# Altium schematic sheet V1.SchDoc
size A2; SheetNumber: 1; SheetTotal: 2
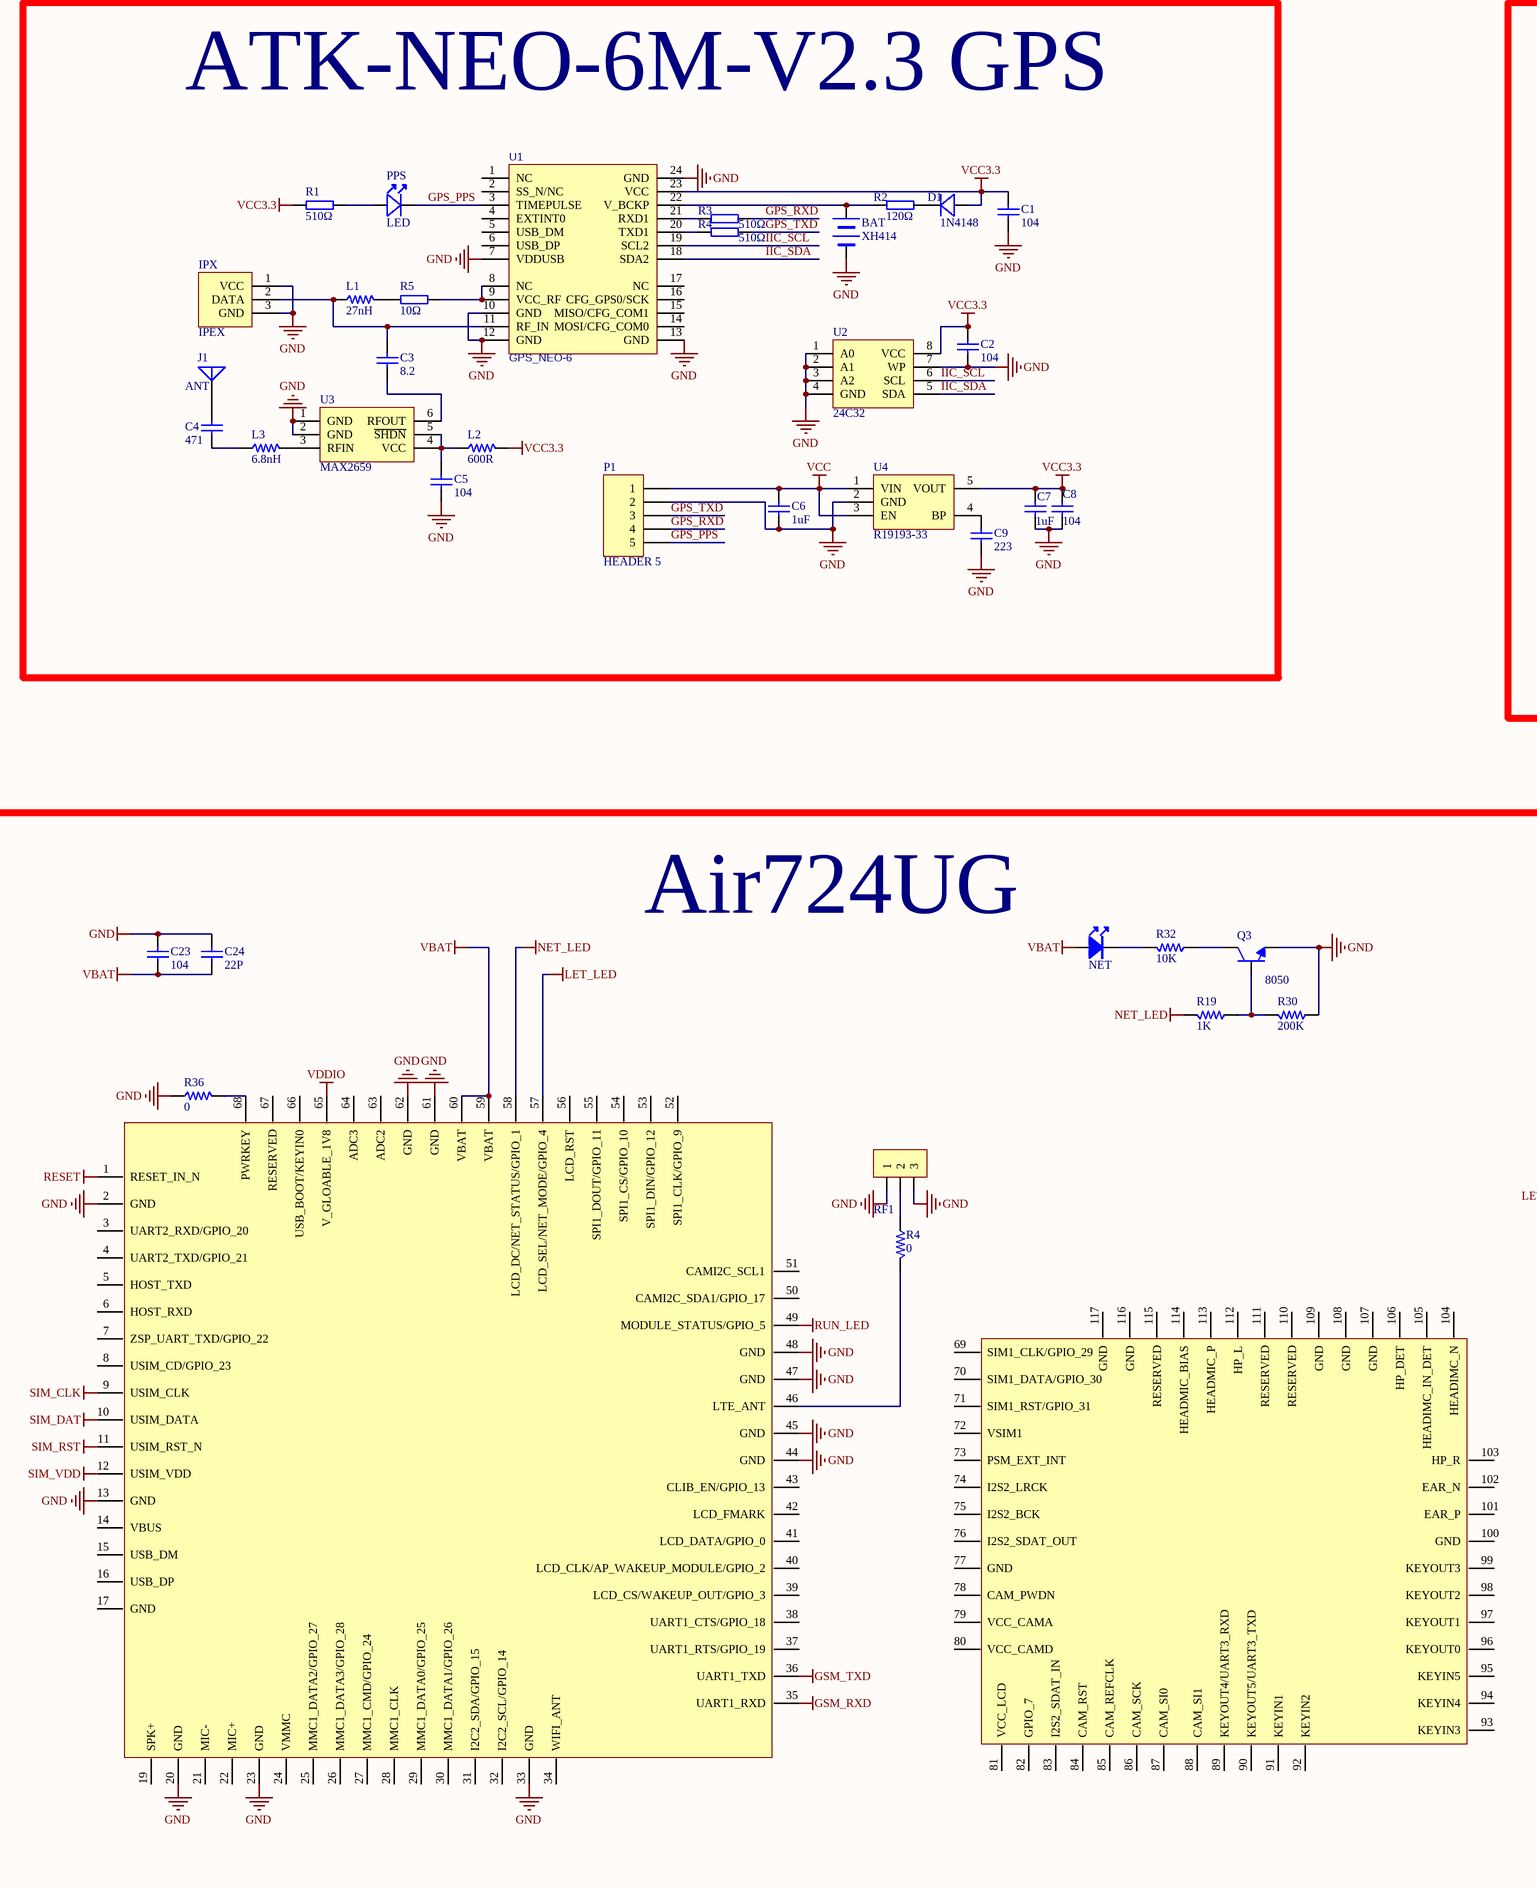
[diagram p0: V1.SchDoc, left]
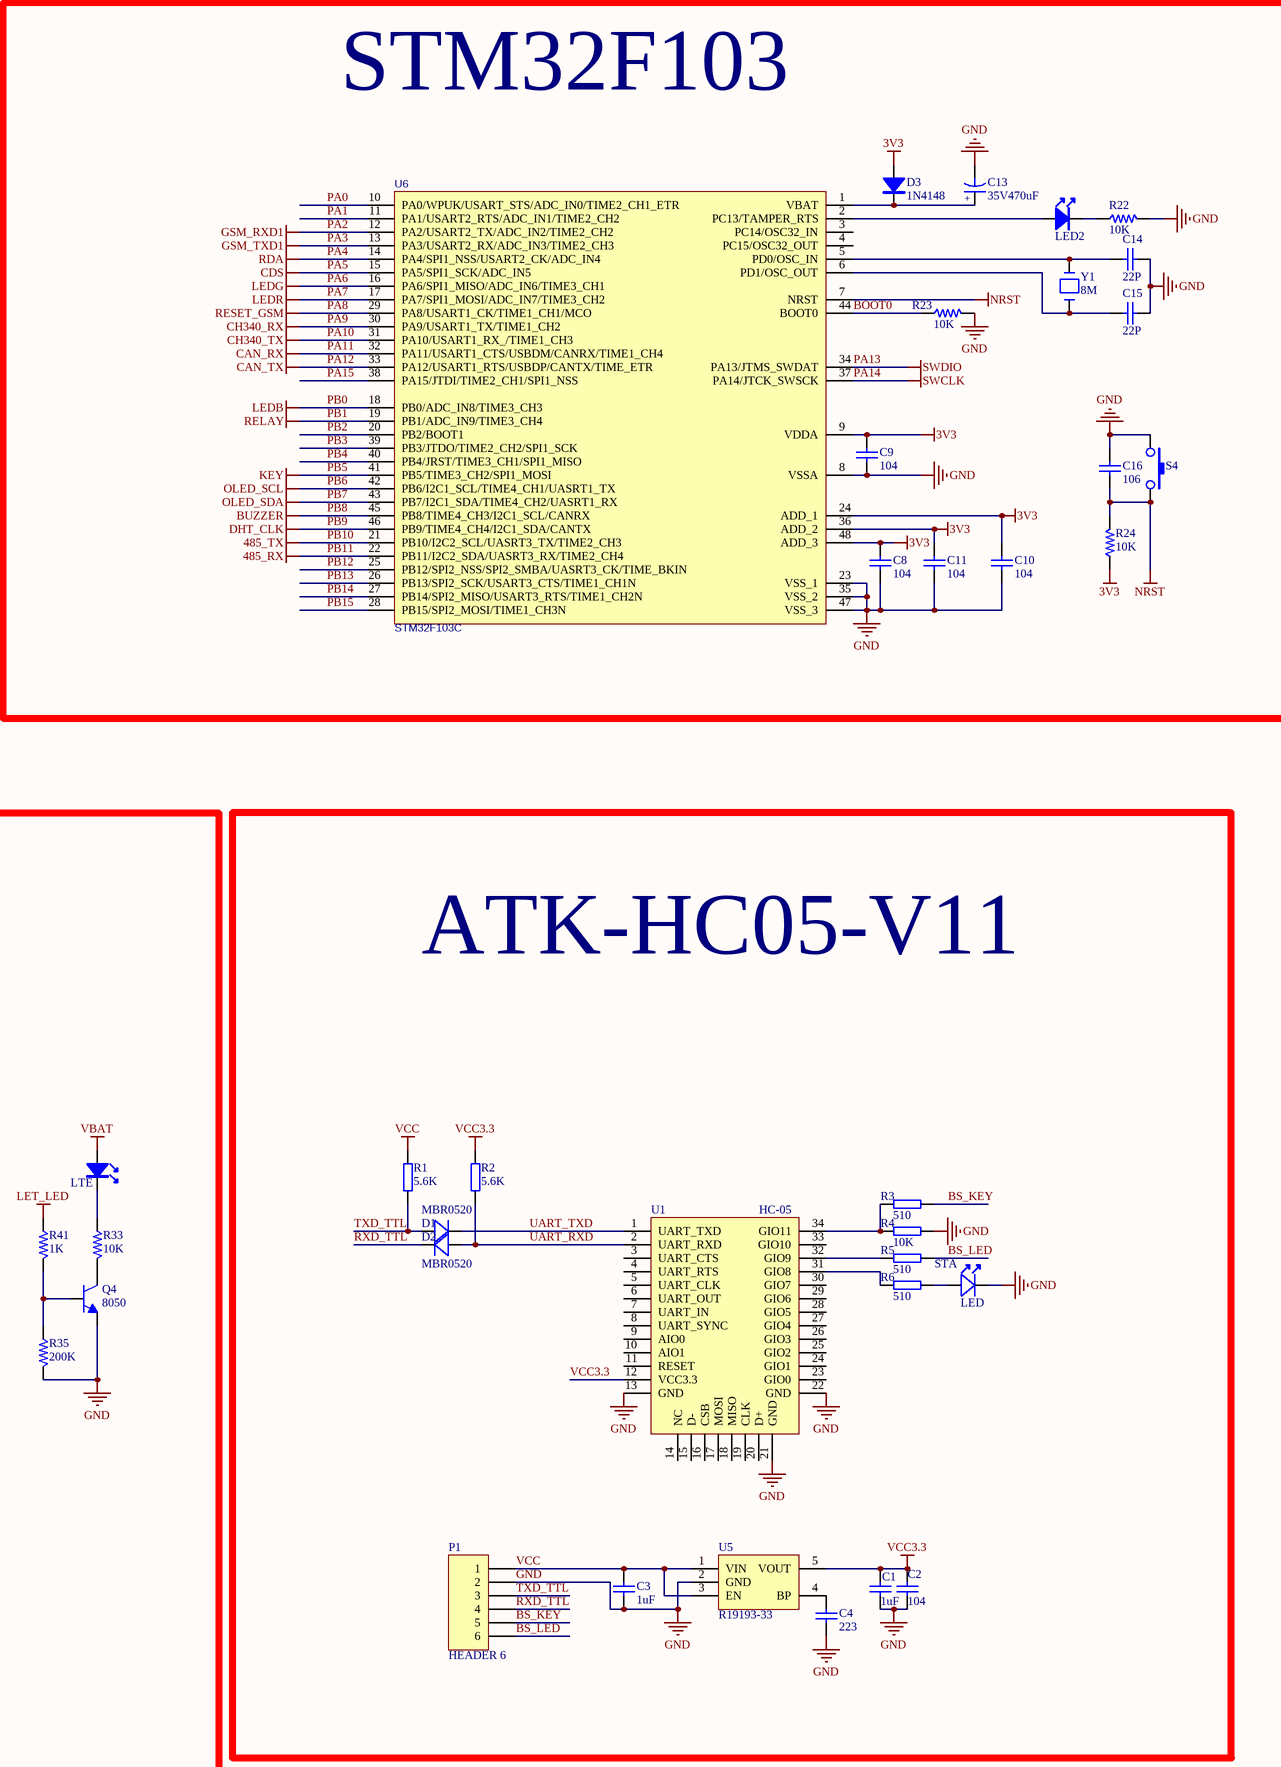
[diagram p1: V1.SchDoc, right]

## Parts
(Parts that share a designator on the sheet are numbered #1, #2 ... from top to bottom, then left to right.)
BAT  XH414  [SIP2]
C1#1  104  [RAD0.1]
C1#2  1uF  [RAD0.1]
C2#1  104  [RAD0.1]
C2#2  104  [RAD0.1]
C3#1  8.2  [RAD0.1]
C3#2  1uF  [RAD0.1]
C4#1  471  [RAD0.1]
C4#2  223  [RAD0.1]
C5  104  [RAD0.1]
C6  1uF  [RAD0.1]
C7  1uF  [RAD0.1]
C8#1  104  [RAD0.1]
C8#2  104  [RAD0.1]
C9#1  104  [RAD0.1]
C9#2  223  [RAD0.1]
C10  104  [RAD0.1]
C11  104  [RAD0.1]
C13  35V470uF  [RB.1/.2]
C14  22P  [RAD0.1]
C15  22P  [RAD0.1]
C16  106  [RAD0.1]
C23  104  [RAD0.1]
C24  22P  [RAD0.1]
D1#1  1N4148  [DIODE0.4]
D1#2  MBR0520  [DIODE0.4]
D2  MBR0520  [DIODE0.4]
D3  1N4148  [DIODE0.4]
IPX  IPEX  [SIP3]
J1  ANT  [SMA-5.08]
L1  27nH  [AXIAL0.4]
L2  600R  [AXIAL0.4]
L3  6.8nH  [AXIAL0.4]
LED2  LED  [LED]  (value not drawn)
LTE  LED  [LED]  (value not drawn)
NET  LED  [LED]  (value not drawn)
P1#1  HEADER 5  [SIP5]
P1#2  HEADER 6  [SIP6]
PPS  LED  [LED]
Q3  8050  [TO-92-EBC]
Q4  8050  [TO-92-EBC]
R1#1  510Ω  [AXIAL0.4]
R1#2  5.6K  [AXIAL0.4]
R2#1  120Ω  [AXIAL0.4]
R2#2  5.6K  [AXIAL0.4]
R3#1  510Ω  [AXIAL0.4]
R3#2  510  [AXIAL0.4]
R4#1  510Ω  [AXIAL0.4]
R4#2  0  [AXIAL0.4]
R4#3  10K  [AXIAL0.4]
R5#1  10Ω  [AXIAL0.4]
R5#2  510  [AXIAL0.4]
R6  510  [AXIAL0.4]
R19  1K  [AXIAL0.4]
R22  10K  [AXIAL0.4]
R23  10K  [AXIAL0.4]
R24  10K  [AXIAL0.4]
R30  200K  [AXIAL0.4]
R32  10K  [AXIAL0.4]
R33  10K  [AXIAL0.4]
R35  200K  [AXIAL0.4]
R36  0  [AXIAL0.4]
R41  1K  [AXIAL0.4]
RF1  CON3  [SIP3]  (value not drawn)
S4  SW-PB  [SW6X6]  (value not drawn)
STA  LED  [LED]
U1#1  GPS_NEO-6  [GPS_NEO-6]
U1#2  HC-05
U2  24C32  [DIP8]
U3  MAX2659
U4  R19193-33
U5  R19193-33
U6  STM32F103C  [LQFP48(STM32F103X8/STM32F103XB)]
U7  Air724UG  [AIR724UG.1]  (value not drawn)  (parts A,B of 2)
Y1  8M  [XTAL1]

## Blocks framed on the sheet
ATK-NEO-6M-V2.3 GPS: BAT C1#1 C2#1 C3#1 C4#1 C5-C7 C8#1 C9#2 D1#1 IPX J1 L1-L3 P1#1 PPS R1#1 R2#1 R3#1 R4#1 R5#1 U1#1 U2-U4
STM32F103: C8#2 C9#1 C10 C11 C13-C16 D3 LED2 R22-R24 S4 U6 Y1
Air724UG: C23 C24 LTE NET Q3 Q4 R4#2 R19 R30 R32 R33 R35 R36 R41 RF1 U7
ATK-HC05-V11: C1#2 C2#2 C3#2 C4#2 D1#2 D2 P1#2 R1#2 R2#2 R3#2 R4#3 R5#2 R6 STA U1#2 U5

## Nets
3V3: C8#2.2 C9#1.2 C10.2 C11.2 D3.1(A) R24.1 U6.9(VDDA) U6.24(ADD_1) U6.36(ADD_2) U6.48(ADD_3)
GND: BAT.2(-) C1#1.2 C1#2.2 C2#1.2 C2#2.2 C3#2.2 C4#2.2 C5.2 C6.2 C7.2 C8#1.2 C8#2.1 C9#1.1 C9#2.2 C10.1 C11.1 C13.2 C14.2 C15.2 C16.2 C23.1 C24.1 IPX.1(VCC) IPX.3(GND) P1#1.2 P1#2.2 Q3.E Q4.E R4#3.1 R22.2 R23.2 R30.1 R35.2 R36.1 RF1.1 RF1.3 S4.1 STA.2 U1#1.7(VDDUSB) U1#1.10(GND) U1#1.12(GND) U1#1.13(GND) U1#1.24(GND) U1#2.13(GND) U1#2.21(GND) U1#2.22(GND) U2.1(A0) U2.2(A1) U2.3(A2) U2.4(GND) U2.7(WP) U3.1(GND) U3.2(GND) U4.2(GND) U5.2(GND) U6.8(VSSA) U6.23(VSS_1) U6.35(VSS_2) U6.47(VSS_3) U7.2(GND) U7.13(GND) U7.20(GND) U7.23(GND) U7.33(GND) U7.44(GND) U7.45(GND) U7.47(GND) U7.48(GND) U7.61(GND) U7.62(GND)
GSM_RXD: U7.35(UART1_RXD)
GSM_TXD: U7.36(UART1_TXD)
LET_LED: R41.1 U7.57(LCD_SEL/NET_MODE/GPIO_4)
NET_LED: R19.2 U7.58(LCD_DC/NET_STATUS/GPIO_1)
NRST: C16.1 R24.2 S4.2 U6.7(NRST)
PA2: U6.12(PA2/USART2_TX/ADC_IN2/TIME2_CH2)  [also labelled GSM_RXD1]
PA3: U6.13(PA3/USART2_RX/ADC_IN3/TIME2_CH3)  [also labelled GSM_TXD1]
PA4: U6.14(PA4/SPI1_NSS/USART2_CK/ADC_IN4)  [also labelled RDA]
PA5: U6.15(PA5/SPI1_SCK/ADC_IN5)  [also labelled CDS]
PA6: U6.16(PA6/SPI1_MISO/ADC_IN6/TIME3_CH1)  [also labelled LEDG]
PA7: U6.17(PA7/SPI1_MOSI/ADC_IN7/TIME3_CH2)  [also labelled LEDR]
PA8: U6.29(PA8/USART1_CK/TIME1_CH1/MCO)  [also labelled RESET_GSM]
PA9: U6.30(PA9/USART1_TX/TIME1_CH2)  [also labelled CH340_RX]
PA10: U6.31(PA10/USART1_RX_/TIME1_CH3)  [also labelled CH340_TX]
PA11: U6.32(PA11/USART1_CTS/USBDM/CANRX/TIME1_CH4)  [also labelled CAN_RX]
PA12: U6.33(PA12/USART1_RTS/USBDP/CANTX/TIME_ETR)  [also labelled CAN_TX]
PA13: U6.34(PA13/JTMS_SWDAT)  [also labelled SWDIO]
PA14: U6.37(PA14/JTCK_SWSCK)  [also labelled SWCLK]
PB0: U6.18(PB0/ADC_IN8/TIME3_CH3)  [also labelled LEDB]
PB1: U6.19(PB1/ADC_IN9/TIME3_CH4)  [also labelled RELAY]
PB5: U6.41(PB5/TIME3_CH2/SPI1_MOSI)  [also labelled KEY]
PB6: U6.42(PB6/I2C1_SCL/TIME4_CH1/UASRT1_TX)  [also labelled OLED_SCL]
PB7: U6.43(PB7/I2C1_SDA/TIME4_CH2/UASRT1_RX)  [also labelled OLED_SDA]
PB8: U6.45(PB8/TIME4_CH3/I2C1_SCL/CANRX)  [also labelled BUZZER]
PB9: U6.46(PB9/TIME4_CH4/I2C1_SDA/CANTX)  [also labelled DHT_CLK]
PB10: U6.21(PB10/I2C2_SCL/UASRT3_TX/TIME2_CH3)  [also labelled 485_TX]
PB11: U6.22(PB11/I2C2_SDA/UASRT3_RX/TIME2_CH4)  [also labelled 485_RX]
RESET: U7.1(RESET_IN_N)
RUN_LED: U7.49(MODULE_STATUS/GPIO_5)
SIM_CLK: U7.9(USIM_CLK)
SIM_DAT: U7.10(USIM_DATA)
SIM_RST: U7.11(USIM_RST_N)
SIM_VDD: U7.12(USIM_VDD)
VBAT: C23.2 C24.2 LTE.1 NET.1 U7.59(VBAT) U7.60(VBAT)
VCC: C3#2.1 C6.1 P1#1.1 P1#2.1 R1#2.2 U4.1(VIN) U4.3(EN) U5.1(VIN) U5.3(EN)
VCC3.3: C1#1.1 C1#2.1 C2#1.1 C2#2.1 C7.1 C8#1.1 D1#1.1(A) L2.2 R1#1.1 R2#2.2 U1#1.23(VCC) U1#2.12(VCC3.3) U2.8(VCC) U4.5(VOUT) U5.5(VOUT)
VDDIO: U7.65(V_GLOABLE_1V8)
BOOT0: R23.1 U6.44(BOOT0)
BS_KEY: P1#2.5 R3#2.1
BS_LED: P1#2.6 R5#2.1
GPS_PPS: P1#1.5 PPS.2 U1#1.3(TIMEPULSE)
GPS_RXD: P1#1.4 R3#1.2
GPS_TXD: P1#1.3 R4#1.2
IIC_SCL: U1#1.19(SCL2) U2.6(SCL)
IIC_SDA: U1#1.18(SDA2) U2.5(SDA)
PA0: U6.10(PA0/WPUK/USART_STS/ADC_IN0/TIME2_CH1_ETR)
PA1: U6.11(PA1/USART2_RTS/ADC_IN1/TIME2_CH2)
PA15: U6.38(PA15/JTDI/TIME2_CH1/SPI1_NSS)
PB2: U6.20(PB2/BOOT1)
PB3: U6.39(PB3/JTDO/TIME2_CH2/SPI1_SCK)
PB4: U6.40(PB4/JRST/TIME3_CH1/SPI1_MISO)
PB12: U6.25(PB12/SPI2_NSS/SPI2_SMBA/UASRT3_CK/TIME_BKIN)
PB13: U6.26(PB13/SPI2_SCK/USART3_CTS/TIME1_CH1N)
PB14: U6.27(PB14/SPI2_MISO/USART3_RTS/TIME1_CH2N)
PB15: U6.28(PB15/SPI2_MOSI/TIME1_CH3N)
RXD_TTL: D2.2(K) P1#2.4
TXD_TTL: D1#2.1(A) P1#2.3 R1#2.1
UART_RXD: D2.1(A) R2#2.1 U1#2.2(UART_RXD)
UART_TXD: D1#2.2(K) U1#2.1(UART_TXD)
NetBAT_1: BAT.1(+) R2#1.1 U1#1.22(V_BCKP)
NetC3#1_1: C3#1.1 IPX.2(DATA) L1.1 U1#1.11(RF_IN)
NetC3#1_2: C3#1.2 U3.6(RFOUT)
NetC4#1_1: C4#1.1 J1.1(A)
NetC4#1_2: C4#1.2 L3.1
NetC4#2_1: C4#2.1 U5.4(BP)
NetC5_1: C5.1 L2.1 U3.4(VCC) U3.5(~{SHDN})
NetC9#2_1: C9#2.1 U4.4(BP)
NetC13_1: C13.1 D3.2(K) U6.1(VBAT)
NetC14_1: C14.1 U6.5(PD0/OSC_IN) Y1.2
NetC15_1: C15.1 U6.6(PD1/OSC_OUT) Y1.1
NetD1#1_2: D1#1.2(K) R2#1.2
NetL1_2: L1.2 R5#1.1
NetL3_2: L3.2 U3.3(RFIN)
NetLED2_1: LED2.1 U6.2(PC13/TAMPER_RTS)
NetLED2_2: LED2.2 R22.1
NetLTE_2: LTE.2 R33.1
NetNET_2: NET.2 R32.2
NetPPS_1: PPS.1 R1#1.2
NetQ3_B: Q3.B R19.1 R30.2
NetQ3_C: Q3.C R32.1
NetQ4_B: Q4.B R35.1 R41.2
NetQ4_C: Q4.C R33.2
NetR3#1_1: R3#1.1 U1#1.21(RXD1)
NetR3#2_2: R3#2.2 R4#3.2 U1#2.34(GIO11)
NetR4#1_1: R4#1.1 U1#1.20(TXD1)
NetR4#2_1: R4#2.1 RF1.2
NetR4#2_2: R4#2.2 U7.46(LTE_ANT)
NetR5#1_2: R5#1.2 U1#1.8(NC) U1#1.9(VCC_RF)
NetR5#2_2: R5#2.2 U1#2.32(GIO9)
NetR6_1: R6.1 STA.1
NetR6_2: R6.2 U1#2.31(GIO8)
NetR36_2: R36.2 U7.68(PWRKEY)

Not connected (* = marked no-connect by the designer): U1#1 1(NC) 2(SS_N/NC) 4(EXTINT0) 5(USB_DM) 6(USB_DP) 14(MOSI/CFG_COM0) 15(MISO/CFG_COM1) 16(CFG_GPS0/SCK) 17(NC); U1#2 3(UART_CTS) 4(UART_RTS) 5(UART_CLK) 6(UART_OUT) 7(UART_IN) 8(UART_SYNC) 9(AIO0) 10(AIO1) 11(RESET) 14(NC) 15(D-) 16(CSB) 17(MOSI) 18(MISO) 19(CLK) 20(D+) 23(GIO0) 24(GIO1) 25(GIO2) 26(GIO3) 27(GIO4) 28(GIO5) 29(GIO6) 30(GIO7) 33(GIO10); U6 3(PC14/OSC32_IN) 4(PC15/OSC32_OUT); U7 3(UART2_RXD/GPIO_20) 4(UART2_TXD/GPIO_21) 5(HOST_TXD) 6(HOST_RXD) 7(ZSP_UART_TXD/GPIO_22) 8(USIM_CD/GPIO_23) 14(VBUS) 15(USB_DM) 16(USB_DP) 17(GND) 19(SPK+) 21(MIC-) 22(MIC+) 24(VMMC) 25(MMC1_DATA2/GPIO_27) 26(MMC1_DATA3/GPIO_28) 27(MMC1_CMD/GPIO_24) 28(MMC1_CLK) 29(MMC1_DATA0/GPIO_25) 30(MMC1_DATA1/GPIO_26) 31(I2C2_SDA/GPIO_15) 32(I2C2_SCL/GPIO_14) 34(WIFI_ANT) 37(UART1_RTS/GPIO_19) 38(UART1_CTS/GPIO_18) 39(LCD_CS/WAKEUP_OUT/GPIO_3) 40(LCD_CLK/AP_WAKEUP_MODULE/GPIO_2) 41(LCD_DATA/GPIO_0) 42(LCD_FMARK) 43(CLIB_EN/GPIO_13) 50(CAMI2C_SDA1/GPIO_17) 51(CAMI2C_SCL1) 52(SPI1_CLK/GPIO_9) 53(SPI1_DIN/GPIO_12) 54(SPI1_CS/GPIO_10) 55(SPI1_DOUT/GPIO_11) 56(LCD_RST) 63(ADC2) 64(ADC3) 66(USB_BOOT/KEYIN0) 67(RESERVED) 69(SIM1_CLK/GPIO_29) 70(SIM1_DATA/GPIO_30) 71(SIM1_RST/GPIO_31) 72(VSIM1) 73(PSM_EXT_INT) 74(I2S2_LRCK) 75(I2S2_BCK) 76(I2S2_SDAT_OUT) 77(GND) 78(CAM_PWDN) 79(VCC_CAMA) 80(VCC_CAMD) 81(VCC_LCD) 82(GPIO_7) 83(I2S2_SDAT_IN) 84(CAM_RST) 85(CAM_REFCLK) 86(CAM_SCK) 87(CAM_SI0) 88(CAM_SI1) 89(KEYOUT4/UART3_RXD) 90(KEYOUT5/UART3_TXD) 91(KEYIN1) 92(KEYIN2) 93(KEYIN3) 94(KEYIN4) 95(KEYIN5) 96(KEYOUT0) 97(KEYOUT1) 98(KEYOUT2) 99(KEYOUT3) 100(GND) 101(EAR_P) 102(EAR_N) 103(HP_R) 104(HEADIMC_N) 105(HEADIMC_IN_DET) 106(HP_DET) 107(GND) 108(GND) 109(GND) 110(RESERVED) 111(RESERVED) 112(HP_L) 113(HEADMIC_P) 114(HEADMIC_BIAS) 115(RESERVED) 116(GND) 117(GND)

## Notes on the sheet
- (in symbol CAPACITOR POL) +

## Library data of the parts
BAT = BATTERY
C1#1 C1#2 C2#1 C2#2 C3#1 C3#2 C4#1 C4#2 C5-C7 C8#1 C8#2 C9#1 C9#2 C10 C11 C14-C16 C23 C24 = CAP: Capacitor
C13 = CAPACITOR POL: Capacitor
D1#1 D1#2 D2 = DIODE2: Diode
D3 = DIODE
IPX = DHT22: 温湿度模块
J1 = ANTENNA: Generic Antenna
L1-L3 R4#2 R19 R22-R24 R30 R32 R33 R35 R36 R41 = RES3: Ω
PPS STA = LED2
Q3 Q4 = NPN1: 9013,9014,9018,8050,2N3904
R1#1 R1#2 R2#1 R2#2 R3#1 R3#2 R4#1 R4#3 R5#1 R5#2 R6 = RES2: Ω
RF1 = CON3: Connector
U1#1 = GPS_NEO-6: Contributor: dyf666; spicePre: U; spiceSymbolName: GPS_NEO-6
U1#2 = HC-05: 蓝牙模块
U6 = STM32F103C: Contributor: meidong0000; spicePre: U; spiceSymbolName: STM32F103C8T6
U7 = Air724UG: subpart_no: 1; Contributor: willa_111; spicePre: U; spiceSymbolName: Air724UG
Y1 = XTAL